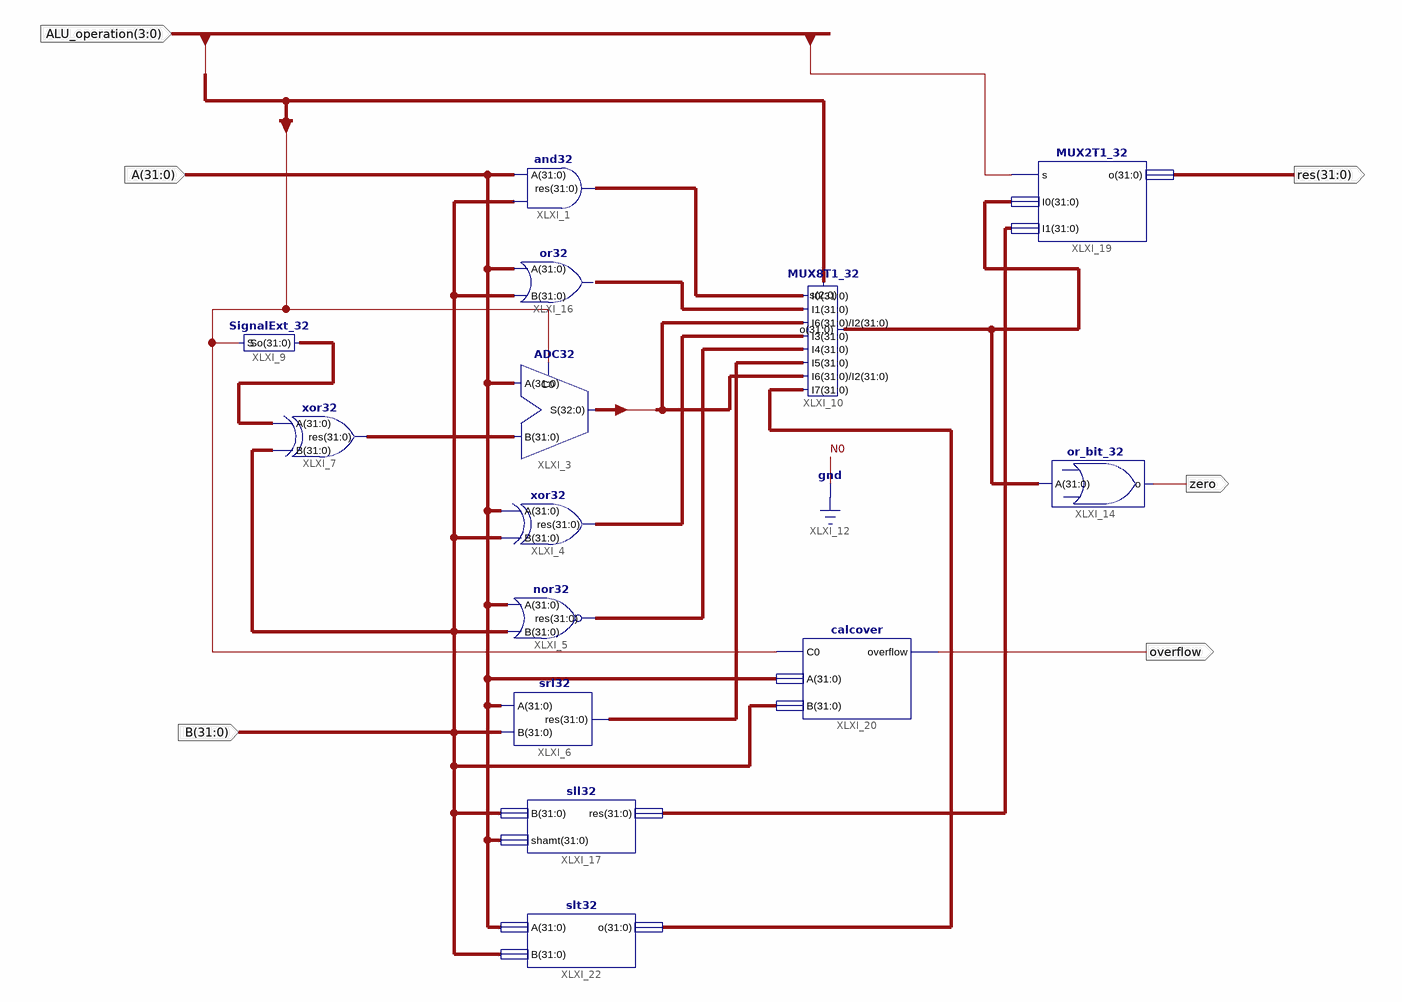
[diagram p0: schematic sheet 1]
// Xilinx ISE schematic alu.sch (kintex7) as structural Verilog: 14 symbols, 6 ports
module alu (
  input  [31:0] A,
  input  [31:0] B,
  input  [3:0] ALU_operation,
  output zero,
  output overflow,
  output [31:0] res
);

  wire [31:0] tmp, XLXN_13, XLXN_17, XLXN_26, XLXN_29, XLXN_30, XLXN_49, XLXN_50, XLXN_54, XLXN_60;
  wire [32:0] S;

  and32 XLXI_1 (.res(XLXN_49), .A(A), .B(B));
  ADC32 XLXI_3 (.B(XLXN_13), .A(A), .C0(ALU_operation[2]), .S(S));
  xor32 XLXI_4 (.A(A), .B(B), .res(XLXN_26));
  nor32 XLXI_5 (.res(XLXN_29), .A(A), .B(B));
  srl32 XLXI_6 (.A(A), .B(B), .res(XLXN_30));
  xor32 XLXI_7 (.A(XLXN_17), .B(B), .res(XLXN_13));
  SignalExt_32 XLXI_9 (.So(XLXN_17), .S(ALU_operation[2]));
  MUX8T1_32 XLXI_10 (
    .s(ALU_operation[2:0]), .I7(XLXN_60), .I6(S[31:0]), .I5(XLXN_30), .I4(XLXN_29), .I3(XLXN_26),
    .I2(S[31:0]), .I1(XLXN_50), .I0(XLXN_49), .o(tmp));
  or_bit_32 XLXI_14 (.o(zero), .A(tmp));
  or32 XLXI_16 (.res(XLXN_50), .A(A), .B(B));
  sll32 XLXI_17 (.B(B), .shamt(A), .res(XLXN_54));
  MUX2T1_32 XLXI_19 (.s(ALU_operation[3]), .I0(tmp), .I1(XLXN_54), .o(res));
  calcover XLXI_20 (.C0(ALU_operation[2]), .A(A), .B(B), .overflow(overflow));
  slt32 XLXI_22 (.A(A), .B(B), .o(XLXN_60));
endmodule
